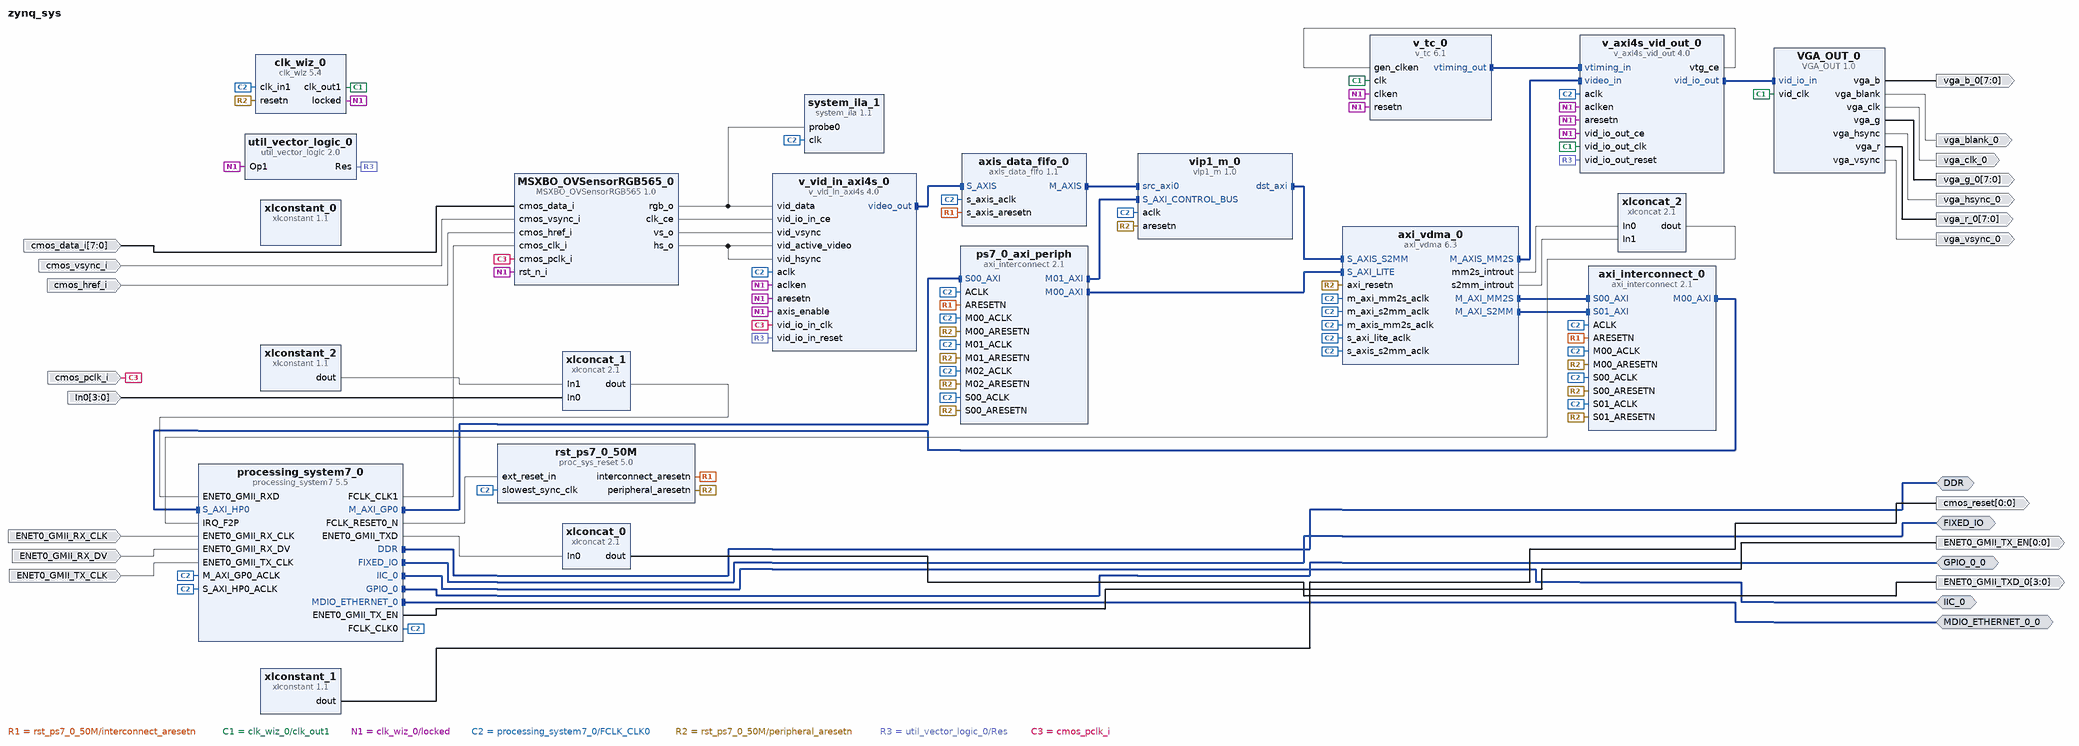
[diagram p0: block diagram of the top level]
# Vivado block design zynq_sys, xc7z010clg400-1, Vivado 2017.4
create_bd_design zynq_sys

create_bd_intf_port -mode Master -vlnv xilinx.com:interface:ddrx_rtl:1.0 DDR
create_bd_intf_port -mode Master -vlnv xilinx.com:display_processing_system7:fixedio_rtl:1.0 FIXED_IO
create_bd_intf_port -mode Master -vlnv xilinx.com:interface:iic_rtl:1.0 IIC_0
create_bd_intf_port -mode Master -vlnv xilinx.com:interface:gpio_rtl:1.0 GPIO_0_0
create_bd_intf_port -mode Master -vlnv xilinx.com:interface:mdio_rtl:1.0 MDIO_ETHERNET_0_0
create_bd_port -dir O -type clk vga_clk_0
create_bd_port -dir O vga_hsync_0
create_bd_port -dir O vga_vsync_0
create_bd_port -dir O vga_blank_0
create_bd_port -dir O -from 7 -to 0 vga_r_0
create_bd_port -dir O -from 7 -to 0 vga_g_0
create_bd_port -dir O -from 7 -to 0 vga_b_0
create_bd_port -dir I -from 7 -to 0 cmos_data_i
create_bd_port -dir I cmos_vsync_i
create_bd_port -dir I cmos_href_i
create_bd_port -dir I cmos_pclk_i
create_bd_port -dir O -from 0 -to 0 cmos_reset
create_bd_port -dir O -from 0 -to 0 ENET0_GMII_TX_EN
create_bd_port -dir O -from 3 -to 0 ENET0_GMII_TXD_0
create_bd_port -dir I -type clk ENET0_GMII_RX_CLK
create_bd_port -dir I ENET0_GMII_RX_DV
create_bd_port -dir I -type clk ENET0_GMII_TX_CLK
create_bd_port -dir I -from 3 -to 0 In0

create_bd_cell -type ip -vlnv xilinx.com:ip:processing_system7:5.5 processing_system7_0
set_property -dict [list \
  CONFIG.PCW_FCLK_CLK1_BUF TRUE \
  CONFIG.PCW_SDIO_PERIPHERAL_FREQMHZ 100 \
  CONFIG.PCW_UART_PERIPHERAL_FREQMHZ 100 \
  CONFIG.PCW_I2C_PERIPHERAL_FREQMHZ 111.111115 \
  CONFIG.PCW_FPGA0_PERIPHERAL_FREQMHZ 100 \
  CONFIG.PCW_FPGA1_PERIPHERAL_FREQMHZ 25 \
  CONFIG.PCW_USE_S_AXI_HP0 1 \
  CONFIG.PCW_USE_FABRIC_INTERRUPT 1 \
  CONFIG.PCW_GPIO_EMIO_GPIO_WIDTH 6 \
  CONFIG.PCW_EN_CLK1_PORT 1 \
  CONFIG.PCW_IRQ_F2P_INTR 1 \
  CONFIG.PCW_UIPARAM_DDR_BUS_WIDTH {16 Bit} \
  CONFIG.PCW_UIPARAM_DDR_PARTNO {MT41K128M16 JT-125} \
  CONFIG.PCW_NAND_PERIPHERAL_ENABLE 1 \
  CONFIG.PCW_NAND_NAND_IO {MIO 0 2.. 14} \
  CONFIG.PCW_ENET0_PERIPHERAL_ENABLE 1 \
  CONFIG.PCW_ENET0_ENET0_IO EMIO \
  CONFIG.PCW_ENET0_GRP_MDIO_ENABLE 1 \
  CONFIG.PCW_ENET0_GRP_MDIO_IO EMIO \
  CONFIG.PCW_ENET_RESET_ENABLE 1 \
  CONFIG.PCW_ENET_RESET_SELECT {Share reset pin} \
  CONFIG.PCW_ENET0_RESET_ENABLE 0 \
  CONFIG.PCW_SD0_PERIPHERAL_ENABLE 1 \
  CONFIG.PCW_SD0_SD0_IO {MIO 40 .. 45} \
  CONFIG.PCW_SD0_GRP_CD_ENABLE 1 \
  CONFIG.PCW_SD0_GRP_CD_IO {MIO 34} \
  CONFIG.PCW_SD0_GRP_WP_ENABLE 0 \
  CONFIG.PCW_UART1_PERIPHERAL_ENABLE 1 \
  CONFIG.PCW_UART1_UART1_IO {MIO 24 .. 25} \
  CONFIG.PCW_USB_RESET_ENABLE 0 \
  CONFIG.PCW_I2C0_PERIPHERAL_ENABLE 1 \
  CONFIG.PCW_I2C0_I2C0_IO EMIO \
  CONFIG.PCW_I2C_RESET_ENABLE 0 \
  CONFIG.PCW_GPIO_MIO_GPIO_ENABLE 1 \
  CONFIG.PCW_GPIO_MIO_GPIO_IO MIO \
  CONFIG.PCW_GPIO_EMIO_GPIO_ENABLE 1 \
  CONFIG.PCW_GPIO_EMIO_GPIO_IO 6 \
  CONFIG.PCW_FPGA_FCLK1_ENABLE 1 \
] [get_bd_cells processing_system7_0]
# 213 more settings of processing_system7_0 are not shown: defaults, MIO pin electricals, DDR timing, and values the tool derives
create_bd_cell -type ip -vlnv xilinx.com:ip:axi_vdma:6.3 axi_vdma_0
set_property -dict [list \
  CONFIG.c_m_axi_mm2s_data_width 64 \
  CONFIG.c_m_axis_mm2s_tdata_width 24 \
  CONFIG.c_include_s2mm_dre 0 \
  CONFIG.c_use_mm2s_fsync 0 \
  CONFIG.c_use_s2mm_fsync 2 \
  CONFIG.c_mm2s_genlock_mode 3 \
  CONFIG.c_s2mm_genlock_mode 2 \
  CONFIG.c_mm2s_max_burst_length 16 \
  CONFIG.c_s2mm_max_burst_length 16 \
  CONFIG.c_include_s2mm 1 \
  CONFIG.c_enable_s2mm_fsync_out 1 \
  CONFIG.c_include_mm2s_dre 0 \
  CONFIG.c_enable_vert_flip 0 \
] [get_bd_cells axi_vdma_0]
create_bd_cell -type ip -vlnv xilinx.com:ip:proc_sys_reset:5.0 rst_ps7_0_50M
create_bd_cell -type ip -vlnv xilinx.com:ip:axi_interconnect:2.1 ps7_0_axi_periph
set_property -dict {CONFIG.NUM_MI 3} [get_bd_cells ps7_0_axi_periph]
create_bd_cell -type ip -vlnv xilinx.com:ip:v_tc:6.1 v_tc_0
set_property -dict [list \
  CONFIG.HAS_AXI4_LITE false \
  CONFIG.HAS_INTC_IF false \
  CONFIG.VIDEO_MODE 1280x1024p \
  CONFIG.enable_detection false \
  CONFIG.enable_generation true \
] [get_bd_cells v_tc_0]
create_bd_cell -type ip -vlnv xilinx.com:ip:v_axi4s_vid_out:4.0 v_axi4s_vid_out_0
set_property -dict {CONFIG.C_HAS_ASYNC_CLK 1} [get_bd_cells v_axi4s_vid_out_0]
create_bd_cell -type ip -vlnv xilinx.com:ip:clk_wiz:5.4 clk_wiz_0
set_property -dict [list \
  CONFIG.CLKOUT2_USED true \
  CONFIG.CLKOUT3_USED true \
  CONFIG.NUM_OUT_CLKS 3 \
  CONFIG.CLKOUT1_REQUESTED_OUT_FREQ 107.964 \
  CONFIG.CLKOUT2_REQUESTED_OUT_FREQ 200 \
  CONFIG.RESET_PORT resetn \
  CONFIG.MMCM_DIVCLK_DIVIDE 7 \
  CONFIG.MMCM_CLKFBOUT_MULT_F 55.750 \
  CONFIG.MMCM_CLKOUT0_DIVIDE_F 7.375 \
  CONFIG.MMCM_CLKOUT1_DIVIDE 4 \
  CONFIG.MMCM_CLKOUT2_DIVIDE 8 \
  CONFIG.RESET_TYPE ACTIVE_LOW \
  CONFIG.CLKOUT1_JITTER 366.349 \
  CONFIG.CLKOUT1_PHASE_ERROR 481.549 \
  CONFIG.CLKOUT2_JITTER 337.002 \
  CONFIG.CLKOUT2_PHASE_ERROR 481.549 \
  CONFIG.CLKOUT3_JITTER 370.449 \
  CONFIG.CLKOUT3_PHASE_ERROR 481.549 \
] [get_bd_cells clk_wiz_0]
create_bd_cell -type ip -vlnv xilinx.com:ip:util_vector_logic:2.0 util_vector_logic_0
set_property -dict {CONFIG.C_SIZE 1 CONFIG.C_OPERATION not} [get_bd_cells util_vector_logic_0]
create_bd_cell -type ip -vlnv deng:user:VGA_OUT:1.0 VGA_OUT_0
create_bd_cell -type ip -vlnv xilinx.com:ip:v_vid_in_axi4s:4.0 v_vid_in_axi4s_0
set_property -dict {CONFIG.C_HAS_ASYNC_CLK 1 CONFIG.C_ADDR_WIDTH 13} [get_bd_cells v_vid_in_axi4s_0]
create_bd_cell -type ip -vlnv xilinx.com:ip:xlconstant:1.1 xlconstant_0
set_property -dict {CONFIG.CONST_WIDTH 3 CONFIG.CONST_VAL 7} [get_bd_cells xlconstant_0]
create_bd_cell -type ip -vlnv xilinx.com:ip:xlconstant:1.1 xlconstant_1
create_bd_cell -type ip -vlnv xilinx.com:ip:axi_interconnect:2.1 axi_interconnect_0
set_property -dict {CONFIG.NUM_SI 2 CONFIG.NUM_MI 1} [get_bd_cells axi_interconnect_0]
create_bd_cell -type ip -vlnv xilinx.com:user:MSXBO_OVSensorRGB565:1.0 MSXBO_OVSensorRGB565_0
create_bd_cell -type ip -vlnv xilinx.com:ip:system_ila:1.1 system_ila_1
set_property -dict [list \
  CONFIG.C_PROBE0_TYPE 0 \
  CONFIG.C_DATA_DEPTH 2048 \
  CONFIG.C_NUM_OF_PROBES 1 \
  CONFIG.ALL_PROBE_SAME_MU true \
  CONFIG.C_MON_TYPE NATIVE \
] [get_bd_cells system_ila_1]
create_bd_cell -type ip -vlnv xilinx.com:ip:xlconcat:2.1 xlconcat_0
set_property -dict {CONFIG.NUM_PORTS 1 CONFIG.IN0_WIDTH 4} [get_bd_cells xlconcat_0]
create_bd_cell -type ip -vlnv xilinx.com:ip:xlconcat:2.1 xlconcat_1
set_property -dict {CONFIG.IN0_WIDTH 4 CONFIG.IN1_WIDTH 4} [get_bd_cells xlconcat_1]
create_bd_cell -type ip -vlnv xilinx.com:ip:xlconstant:1.1 xlconstant_2
set_property -dict {CONFIG.CONST_WIDTH 4 CONFIG.CONST_VAL 0} [get_bd_cells xlconstant_2]
create_bd_cell -type ip -vlnv xilinx.com:hls:vip1_m:1.0 vip1_m_0
create_bd_cell -type ip -vlnv xilinx.com:ip:axis_data_fifo:1.1 axis_data_fifo_0
set_property -dict {CONFIG.FIFO_DEPTH 32768} [get_bd_cells axis_data_fifo_0]
create_bd_cell -type ip -vlnv xilinx.com:ip:xlconcat:2.1 xlconcat_2

# ---- connections ----

connect_bd_intf_net [get_bd_intf_pins processing_system7_0/M_AXI_GP0] [get_bd_intf_pins ps7_0_axi_periph/S00_AXI]
connect_bd_intf_net [get_bd_intf_pins ps7_0_axi_periph/M00_AXI] [get_bd_intf_pins axi_vdma_0/S_AXI_LITE]
connect_bd_intf_net [get_bd_intf_pins v_tc_0/vtiming_out] [get_bd_intf_pins v_axi4s_vid_out_0/vtiming_in]
connect_bd_intf_net [get_bd_intf_pins VGA_OUT_0/vid_io_in] [get_bd_intf_pins v_axi4s_vid_out_0/vid_io_out]
connect_bd_intf_net [get_bd_intf_pins axi_vdma_0/M_AXI_MM2S] [get_bd_intf_pins axi_interconnect_0/S00_AXI]
connect_bd_intf_net [get_bd_intf_pins axi_interconnect_0/M00_AXI] [get_bd_intf_pins processing_system7_0/S_AXI_HP0]
connect_bd_intf_net [get_bd_intf_pins axi_vdma_0/M_AXI_S2MM] [get_bd_intf_pins axi_interconnect_0/S01_AXI]
connect_bd_intf_net [get_bd_intf_pins axi_vdma_0/M_AXIS_MM2S] [get_bd_intf_pins v_axi4s_vid_out_0/video_in]
connect_bd_intf_net [get_bd_intf_pins ps7_0_axi_periph/M01_AXI] [get_bd_intf_pins vip1_m_0/S_AXI_CONTROL_BUS]
connect_bd_intf_net [get_bd_intf_pins vip1_m_0/dst_axi] [get_bd_intf_pins axi_vdma_0/S_AXIS_S2MM]
connect_bd_intf_net [get_bd_intf_pins v_vid_in_axi4s_0/video_out] [get_bd_intf_pins axis_data_fifo_0/S_AXIS]
connect_bd_intf_net [get_bd_intf_pins axis_data_fifo_0/M_AXIS] [get_bd_intf_pins vip1_m_0/src_axi0]
connect_bd_intf_net [get_bd_intf_ports DDR] [get_bd_intf_pins processing_system7_0/DDR]
connect_bd_intf_net [get_bd_intf_ports FIXED_IO] [get_bd_intf_pins processing_system7_0/FIXED_IO]
connect_bd_intf_net [get_bd_intf_ports IIC_0] [get_bd_intf_pins processing_system7_0/IIC_0]
connect_bd_intf_net [get_bd_intf_ports GPIO_0_0] [get_bd_intf_pins processing_system7_0/GPIO_0]
connect_bd_intf_net [get_bd_intf_ports MDIO_ETHERNET_0_0] [get_bd_intf_pins processing_system7_0/MDIO_ETHERNET_0]
connect_bd_net [get_bd_pins processing_system7_0/FCLK_RESET0_N] [get_bd_pins rst_ps7_0_50M/ext_reset_in]
connect_bd_net [get_bd_pins rst_ps7_0_50M/interconnect_aresetn] \
  [get_bd_pins axis_data_fifo_0/s_axis_aresetn] [get_bd_pins ps7_0_axi_periph/ARESETN] \
  [get_bd_pins axi_interconnect_0/ARESETN]
connect_bd_net [get_bd_pins clk_wiz_0/clk_out1] \
  [get_bd_pins v_tc_0/clk] [get_bd_pins v_axi4s_vid_out_0/vid_io_out_clk] [get_bd_pins VGA_OUT_0/vid_clk]
connect_bd_net [get_bd_pins clk_wiz_0/locked] \
  [get_bd_pins v_axi4s_vid_out_0/aresetn] [get_bd_pins v_tc_0/resetn] [get_bd_pins v_tc_0/clken] \
  [get_bd_pins v_axi4s_vid_out_0/vid_io_out_ce] [get_bd_pins v_axi4s_vid_out_0/aclken] [get_bd_pins util_vector_logic_0/Op1] \
  [get_bd_pins v_vid_in_axi4s_0/aclken] [get_bd_pins v_vid_in_axi4s_0/aresetn] [get_bd_pins v_vid_in_axi4s_0/axis_enable] \
  [get_bd_pins MSXBO_OVSensorRGB565_0/rst_n_i]
connect_bd_net [get_bd_pins v_axi4s_vid_out_0/vtg_ce] [get_bd_pins v_tc_0/gen_clken]
connect_bd_net [get_bd_pins processing_system7_0/FCLK_CLK0] \
  [get_bd_pins processing_system7_0/M_AXI_GP0_ACLK] [get_bd_pins rst_ps7_0_50M/slowest_sync_clk] \
  [get_bd_pins processing_system7_0/S_AXI_HP0_ACLK] [get_bd_pins axi_vdma_0/s_axi_lite_aclk] [get_bd_pins clk_wiz_0/clk_in1] \
  [get_bd_pins v_axi4s_vid_out_0/aclk] [get_bd_pins axi_vdma_0/m_axi_mm2s_aclk] [get_bd_pins axi_vdma_0/m_axis_mm2s_aclk] \
  [get_bd_pins v_vid_in_axi4s_0/aclk] [get_bd_pins axi_vdma_0/m_axi_s2mm_aclk] [get_bd_pins axi_vdma_0/s_axis_s2mm_aclk] \
  [get_bd_pins system_ila_1/clk] [get_bd_pins vip1_m_0/aclk] [get_bd_pins axis_data_fifo_0/s_axis_aclk] \
  [get_bd_pins ps7_0_axi_periph/S00_ACLK] [get_bd_pins ps7_0_axi_periph/M00_ACLK] [get_bd_pins ps7_0_axi_periph/ACLK] \
  [get_bd_pins axi_interconnect_0/S00_ACLK] [get_bd_pins axi_interconnect_0/M00_ACLK] [get_bd_pins axi_interconnect_0/ACLK] \
  [get_bd_pins axi_interconnect_0/S01_ACLK] [get_bd_pins ps7_0_axi_periph/M01_ACLK] [get_bd_pins ps7_0_axi_periph/M02_ACLK]
connect_bd_net [get_bd_pins rst_ps7_0_50M/peripheral_aresetn] \
  [get_bd_pins axi_vdma_0/axi_resetn] [get_bd_pins clk_wiz_0/resetn] [get_bd_pins vip1_m_0/aresetn] \
  [get_bd_pins ps7_0_axi_periph/S00_ARESETN] [get_bd_pins ps7_0_axi_periph/M00_ARESETN] \
  [get_bd_pins axi_interconnect_0/S00_ARESETN] [get_bd_pins axi_interconnect_0/M00_ARESETN] \
  [get_bd_pins axi_interconnect_0/S01_ARESETN] [get_bd_pins ps7_0_axi_periph/M01_ARESETN] \
  [get_bd_pins ps7_0_axi_periph/M02_ARESETN]
connect_bd_net [get_bd_pins util_vector_logic_0/Res] [get_bd_pins v_axi4s_vid_out_0/vid_io_out_reset] [get_bd_pins v_vid_in_axi4s_0/vid_io_in_reset]
connect_bd_net [get_bd_pins VGA_OUT_0/vga_clk] [get_bd_ports vga_clk_0]
connect_bd_net [get_bd_pins VGA_OUT_0/vga_hsync] [get_bd_ports vga_hsync_0]
connect_bd_net [get_bd_pins VGA_OUT_0/vga_vsync] [get_bd_ports vga_vsync_0]
connect_bd_net [get_bd_pins VGA_OUT_0/vga_blank] [get_bd_ports vga_blank_0]
connect_bd_net [get_bd_pins VGA_OUT_0/vga_r] [get_bd_ports vga_r_0]
connect_bd_net [get_bd_pins VGA_OUT_0/vga_g] [get_bd_ports vga_g_0]
connect_bd_net [get_bd_pins VGA_OUT_0/vga_b] [get_bd_ports vga_b_0]
connect_bd_net [get_bd_ports cmos_data_i] [get_bd_pins MSXBO_OVSensorRGB565_0/cmos_data_i]
connect_bd_net [get_bd_ports cmos_vsync_i] [get_bd_pins MSXBO_OVSensorRGB565_0/cmos_vsync_i]
connect_bd_net [get_bd_ports cmos_href_i] [get_bd_pins MSXBO_OVSensorRGB565_0/cmos_href_i]
connect_bd_net [get_bd_ports cmos_pclk_i] [get_bd_pins v_vid_in_axi4s_0/vid_io_in_clk] [get_bd_pins MSXBO_OVSensorRGB565_0/cmos_pclk_i]
connect_bd_net [get_bd_pins MSXBO_OVSensorRGB565_0/rgb_o] [get_bd_pins v_vid_in_axi4s_0/vid_data] [get_bd_pins system_ila_1/probe0]
connect_bd_net [get_bd_pins MSXBO_OVSensorRGB565_0/clk_ce] [get_bd_pins v_vid_in_axi4s_0/vid_io_in_ce]
connect_bd_net [get_bd_pins MSXBO_OVSensorRGB565_0/vs_o] [get_bd_pins v_vid_in_axi4s_0/vid_vsync]
connect_bd_net [get_bd_pins MSXBO_OVSensorRGB565_0/hs_o] [get_bd_pins v_vid_in_axi4s_0/vid_hsync] [get_bd_pins v_vid_in_axi4s_0/vid_active_video]
connect_bd_net [get_bd_pins processing_system7_0/FCLK_CLK1] [get_bd_pins MSXBO_OVSensorRGB565_0/cmos_clk_i]
connect_bd_net [get_bd_pins xlconstant_1/dout] [get_bd_ports cmos_reset]
connect_bd_net [get_bd_pins processing_system7_0/ENET0_GMII_TX_EN] [get_bd_ports ENET0_GMII_TX_EN]
connect_bd_net [get_bd_pins processing_system7_0/ENET0_GMII_TXD] [get_bd_pins xlconcat_0/In0]
connect_bd_net [get_bd_pins xlconcat_0/dout] [get_bd_ports ENET0_GMII_TXD_0]
connect_bd_net [get_bd_ports ENET0_GMII_RX_CLK] [get_bd_pins processing_system7_0/ENET0_GMII_RX_CLK]
connect_bd_net [get_bd_ports ENET0_GMII_RX_DV] [get_bd_pins processing_system7_0/ENET0_GMII_RX_DV]
connect_bd_net [get_bd_ports ENET0_GMII_TX_CLK] [get_bd_pins processing_system7_0/ENET0_GMII_TX_CLK]
connect_bd_net [get_bd_pins xlconstant_2/dout] [get_bd_pins xlconcat_1/In1]
connect_bd_net -net In0_1 [get_bd_ports In0] [get_bd_pins xlconcat_1/In0]
connect_bd_net [get_bd_pins xlconcat_1/dout] [get_bd_pins processing_system7_0/ENET0_GMII_RXD]
connect_bd_net [get_bd_pins axi_vdma_0/mm2s_introut] [get_bd_pins xlconcat_2/In0]
connect_bd_net [get_bd_pins axi_vdma_0/s2mm_introut] [get_bd_pins xlconcat_2/In1]
connect_bd_net [get_bd_pins xlconcat_2/dout] [get_bd_pins processing_system7_0/IRQ_F2P]

# ---- address map ----
assign_bd_address -offset 0x00000000 -range 256M -target_address_space [get_bd_addr_spaces axi_vdma_0/Data_MM2S] [get_bd_addr_segs processing_system7_0/S_AXI_HP0/HP0_DDR_LOWOCM]
assign_bd_address -offset 0x00000000 -range 256M -target_address_space [get_bd_addr_spaces axi_vdma_0/Data_S2MM] [get_bd_addr_segs processing_system7_0/S_AXI_HP0/HP0_DDR_LOWOCM]
assign_bd_address -offset 0x43000000 -range 64K -target_address_space [get_bd_addr_spaces processing_system7_0/Data] [get_bd_addr_segs axi_vdma_0/S_AXI_LITE/Reg]
assign_bd_address -offset 0x43C00000 -range 64K -target_address_space [get_bd_addr_spaces processing_system7_0/Data] [get_bd_addr_segs vip1_m_0/S_AXI_CONTROL_BUS/Reg]

validate_bd_design
save_bd_design
